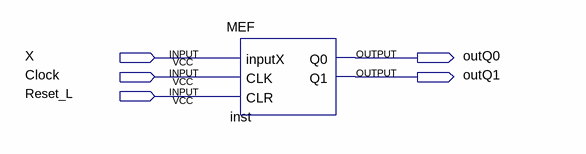
[diagram p0: schematic sheet]
// Quartus schematic ISDSim2.bdf as structural Verilog: 1 symbols, 5 pins
module ISDSim2 (
  input  X,
  input  Clock,
  input  Reset_L,
  output outQ0,
  output outQ1
);

  MEF inst (.inputX(X), .CLK(Clock), .CLR(Reset_L), .Q0(outQ0), .Q1(outQ1));
endmodule
